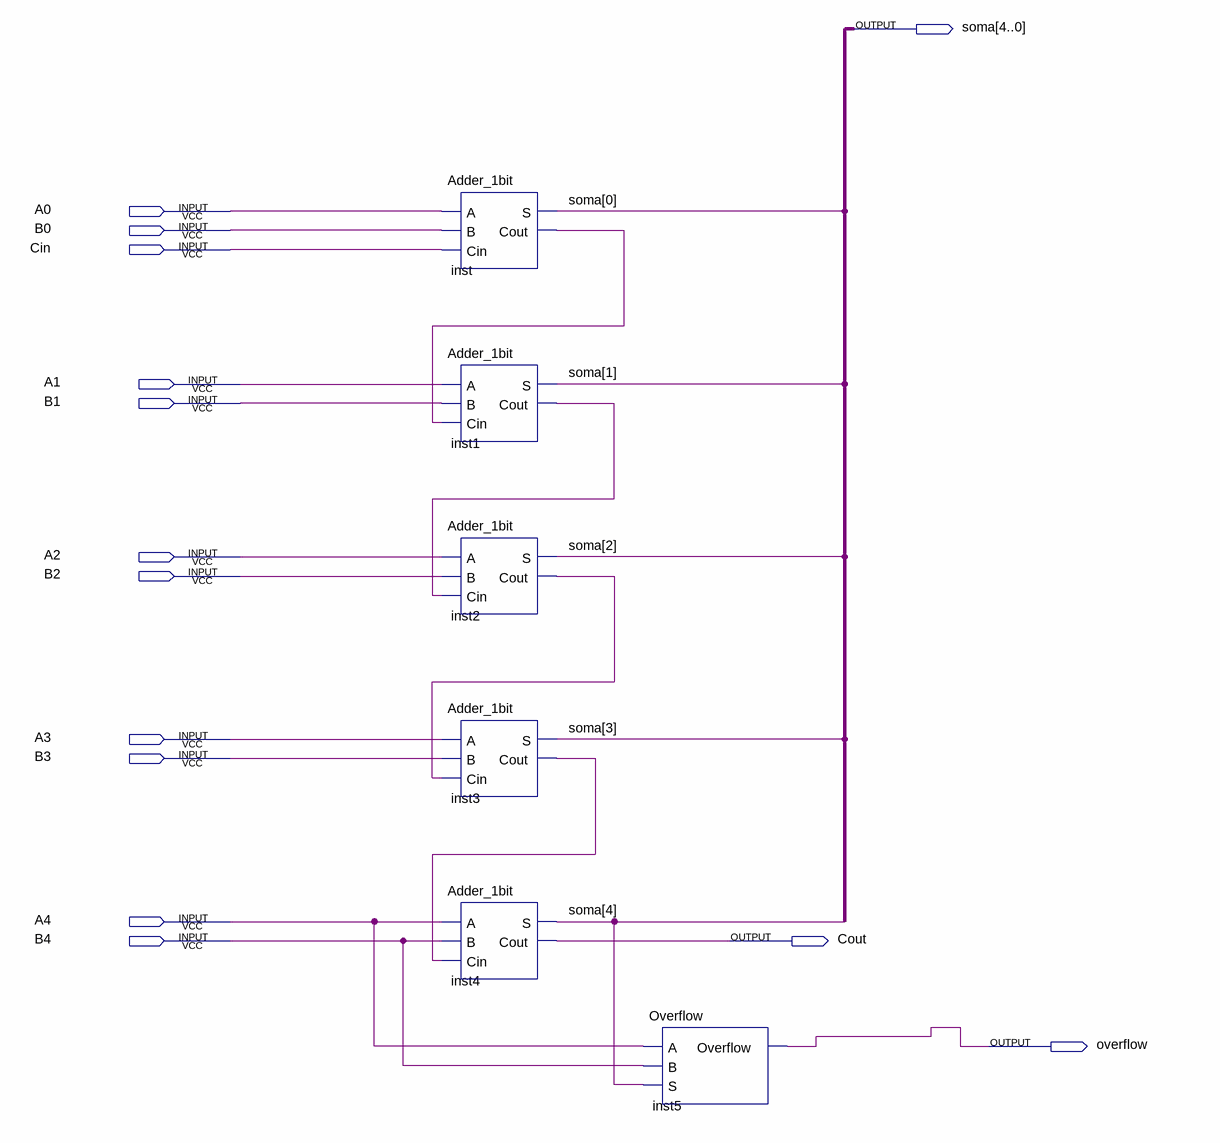
[diagram p0: schematic sheet]
// Quartus schematic Adder.bdf as structural Verilog: 6 symbols, 14 pins
module Adder (
  input  A0,
  input  B0,
  input  Cin,
  input  A1,
  input  B1,
  input  A2,
  input  B2,
  input  A3,
  input  B3,
  input  A4,
  input  B4,
  output [4:0] soma,
  output Cout,
  output overflow
);

  wire inst1_cout, inst2_cout, inst3_cout, inst_cout;

  Adder_1bit inst (.A(A0), .B(B0), .Cin(Cin), .S(soma[0]), .Cout(inst_cout));
  Adder_1bit inst1 (.A(A1), .B(B1), .Cin(inst_cout), .S(soma[1]), .Cout(inst1_cout));
  Adder_1bit inst2 (.A(A2), .B(B2), .Cin(inst1_cout), .S(soma[2]), .Cout(inst2_cout));
  Adder_1bit inst3 (.A(A3), .B(B3), .Cin(inst2_cout), .S(soma[3]), .Cout(inst3_cout));
  Adder_1bit inst4 (.A(A4), .B(B4), .Cin(inst3_cout), .S(soma[4]), .Cout(Cout));
  Overflow inst5 (.A(A4), .B(B4), .S(soma[4]), .Overflow(overflow));
endmodule
